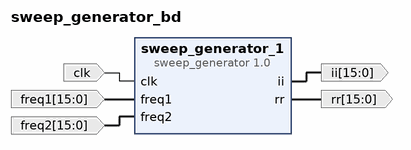
[diagram p0: block diagram of the top level]
# Vivado block design sweep_generator_bd, xc7k160tfbg484-2, Vivado 2021.2
create_bd_design sweep_generator_bd

create_bd_port -dir I -type clk clk
create_bd_port -dir I -from 15 -to 0 -type data freq1
create_bd_port -dir I -from 15 -to 0 -type data freq2
create_bd_port -dir O -from 15 -to 0 -type data ii
create_bd_port -dir O -from 15 -to 0 -type data rr

create_bd_cell -type ip -vlnv User_Company:SysGen:sweep_generator:1.0 sweep_generator_1

# ---- connections ----

connect_bd_net [get_bd_ports clk] [get_bd_pins sweep_generator_1/clk]
connect_bd_net -net freq1_1 [get_bd_ports freq1] [get_bd_pins sweep_generator_1/freq1]
connect_bd_net -net freq2_1 [get_bd_ports freq2] [get_bd_pins sweep_generator_1/freq2]
connect_bd_net [get_bd_pins sweep_generator_1/ii] [get_bd_ports ii]
connect_bd_net [get_bd_pins sweep_generator_1/rr] [get_bd_ports rr]

validate_bd_design
save_bd_design
